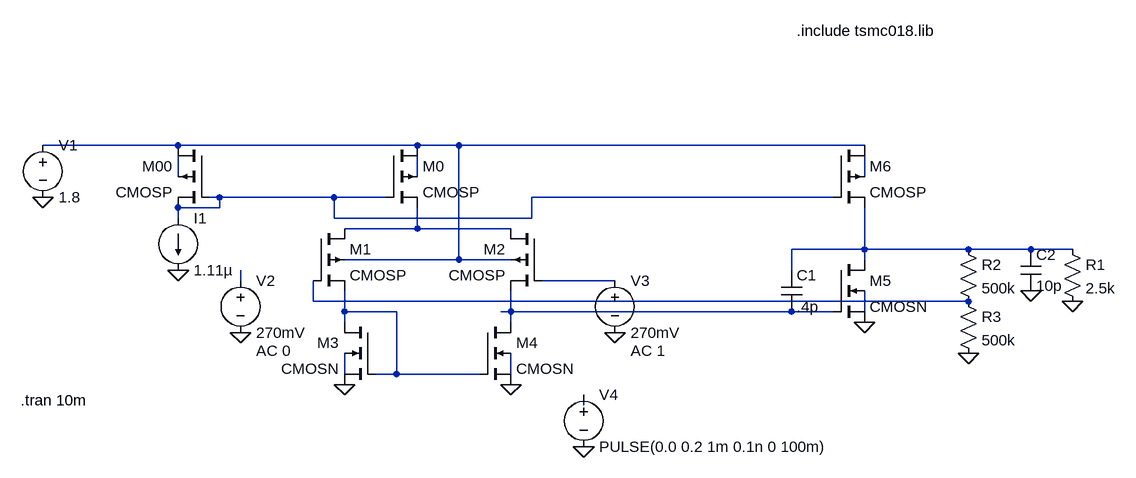
[diagram p0: schematic opampdesign.asc]
opampdesign.asc, the LTspice schematic file:
Version 4
SHEET 1 1980 680
WIRE -448 -32 -656 -32
WIRE -80 -32 -448 -32
WIRE -16 -32 -80 -32
WIRE 608 -32 -16 -32
WIRE -448 16 -448 -16
WIRE -80 16 -80 -16
WIRE 608 16 608 -16
WIRE -384 48 -400 48
WIRE -208 48 -384 48
WIRE -128 48 -208 48
WIRE 560 48 96 48
WIRE -384 64 -384 48
WIRE -384 64 -448 64
WIRE -448 80 -448 64
WIRE -208 80 -208 48
WIRE 96 80 96 48
WIRE 96 80 -208 80
WIRE -80 96 -80 64
WIRE -80 96 -192 96
WIRE 64 96 -80 96
WIRE 608 128 608 64
WIRE 608 128 496 128
WIRE 768 128 608 128
WIRE 864 128 768 128
WIRE 928 128 864 128
WIRE -16 144 -16 -32
WIRE -16 144 -192 144
WIRE 64 144 -16 144
WIRE 608 144 608 128
WIRE 496 160 496 128
WIRE -352 176 -352 160
WIRE 224 176 112 176
WIRE -240 208 -240 176
WIRE 768 208 -240 208
WIRE -192 224 -192 192
WIRE -112 224 -192 224
WIRE 64 224 64 192
WIRE 64 224 48 224
WIRE 496 224 64 224
WIRE 560 224 496 224
WIRE 608 224 608 192
WIRE -192 240 -192 224
WIRE 64 240 64 224
WIRE -192 320 -192 288
WIRE -112 320 -112 224
WIRE -112 320 -144 320
WIRE 16 320 -112 320
WIRE 64 320 64 288
WIRE 176 368 176 352
FLAG -192 336 0
FLAG 64 336 0
FLAG -656 48 0
FLAG -352 256 0
FLAG 224 256 0
FLAG 608 240 0
FLAG 928 208 0
FLAG 864 192 0
FLAG 768 288 0
FLAG 176 432 0
FLAG -448 160 0
DATAFLAG -384 -32 ""
SYMBOL pmos4 -128 -32 R0
SYMATTR InstName M0
SYMATTR Value CMOSP
SYMATTR Value2 l=1.8u w=18u ad=6.48e-12 as=6.48e-12 pd=36.72e-6 ps=36.72e-6
SYMBOL pmos4 -400 -32 M0
SYMATTR InstName M00
SYMATTR Value CMOSP
SYMATTR Value2 l=1.8u w=1.8u ad=0.648e-12 as=0.648e-12 pd=4.32e-6 ps=4.32e-6
SYMBOL pmos4 -240 96 R0
SYMATTR InstName M1
SYMATTR Value CMOSP
SYMATTR Value2 l=1.8u w=9u ad=3.24e-12 as=3.24e-12 pd=18.72e-6 ps=18.72e-6
SYMBOL pmos4 112 96 M0
SYMATTR InstName M2
SYMATTR Value CMOSP
SYMATTR Value2 l=1.8u w=9u ad=3.24e-12 as=3.24e-12 pd=18.72e-6 ps=18.72e-6
SYMBOL nmos4 16 240 R0
SYMATTR InstName M4
SYMATTR Value CMOSN
SYMATTR Value2 l=1.8u w=2.174u ad=0.78264e-12 as=0.78264e-12 pd=5.068e-6 ps=5.068e-6
SYMBOL nmos4 -144 240 M0
SYMATTR InstName M3
SYMATTR Value CMOSN
SYMATTR Value2 l=1.8u w=2.174u ad=0.78264e-12 as=0.78264e-12 pd=5.068e-6 ps=5.068e-6
SYMBOL voltage -656 -48 R0
WINDOW 123 0 0 Left 0
WINDOW 39 0 0 Left 0
SYMATTR InstName V1
SYMATTR Value 1.8
SYMBOL voltage -352 160 R0
WINDOW 123 24 124 Left 2
WINDOW 39 0 0 Left 0
SYMATTR InstName V2
SYMATTR Value 270mV
SYMATTR Value2 AC 0
SYMBOL voltage 224 160 R0
WINDOW 123 24 124 Left 2
WINDOW 39 0 0 Left 0
SYMATTR InstName V3
SYMATTR Value 270mV
SYMATTR Value2 AC 1
SYMBOL pmos4 560 -32 R0
SYMATTR InstName M6
SYMATTR Value CMOSP
SYMATTR Value2 l=1.0u w=793u ad=106e-12 as=106e-12 pd=600u ps=600u
SYMBOL nmos4 560 144 R0
SYMATTR InstName M5
SYMATTR Value CMOSN
SYMATTR Value2 l=1.8u w=217.4u ad=78.264e-12 as=78.264e-12 pd=442e-6 ps=442e-6
SYMBOL cap 848 128 R0
SYMATTR InstName C2
SYMATTR Value 10p
SYMBOL res 912 112 R0
SYMATTR InstName R1
SYMATTR Value 2.5k
SYMBOL cap 480 160 R0
SYMATTR InstName C1
SYMATTR Value .4p
SYMBOL res 752 112 R0
SYMATTR InstName R2
SYMATTR Value 500k
SYMBOL res 752 192 R0
SYMATTR InstName R3
SYMATTR Value 500k
SYMBOL voltage 176 336 R0
WINDOW 123 0 0 Left 0
WINDOW 39 0 0 Left 0
SYMATTR InstName V4
SYMATTR Value PULSE(0.0 0.2 1m 0.1n 0 100m)
SYMBOL current -448 80 R0
WINDOW 123 0 0 Left 0
WINDOW 39 0 0 Left 0
SYMATTR InstName I1
SYMATTR Value 1.11µ
TEXT 504 -208 Left 2 !.include tsmc018.lib
TEXT -690 360 Left 2 !.tran 10m

The netlist it stands for:
* opampdesign.asc
M0 N001 N005 N006 N003 CMOSP l=1.8u w=18u ad=6.48e-12 as=6.48e-12 pd=36.72e-6 ps=36.72e-6
M00 N001 N005 N005 N002 CMOSP l=1.8u w=1.8u ad=0.648e-12 as=0.648e-12 pd=4.32e-6 ps=4.32e-6
M1 N006 N010 N011 N001 CMOSP l=1.8u w=9u ad=3.24e-12 as=3.24e-12 pd=18.72e-6 ps=18.72e-6
M2 N006 N009 N012 N001 CMOSP l=1.8u w=9u ad=3.24e-12 as=3.24e-12 pd=18.72e-6 ps=18.72e-6
M4 N012 N011 0 N015 CMOSN l=1.8u w=2.174u ad=0.78264e-12 as=0.78264e-12 pd=5.068e-6 ps=5.068e-6
M3 N011 N011 0 N014 CMOSN l=1.8u w=2.174u ad=0.78264e-12 as=0.78264e-12 pd=5.068e-6 ps=5.068e-6
V1 N001 0 1.8
V2 N008 0 270mV AC 0
V3 N009 0 270mV AC 1
M6 N001 N005 N007 N004 CMOSP l=1.0u w=793u ad=106e-12 as=106e-12 pd=600u ps=600u
M5 N007 N012 0 N013 CMOSN l=1.8u w=217.4u ad=78.264e-12 as=78.264e-12 pd=442e-6 ps=442e-6
C2 N007 0 10p
R1 N007 0 2.5k
C1 N007 N012 .4p
R2 N007 N010 500k
R3 N010 0 500k
V4 N016 0 PULSE(0.0 0.2 1m 0.1n 0 100m)
I1 N005 0 1.11µ
.model NMOS NMOS
.model PMOS PMOS
.lib standard.mos
.include tsmc018.lib
.tran 10m
.backanno
.end